# Altium project Ball_dropper.PrjPcb
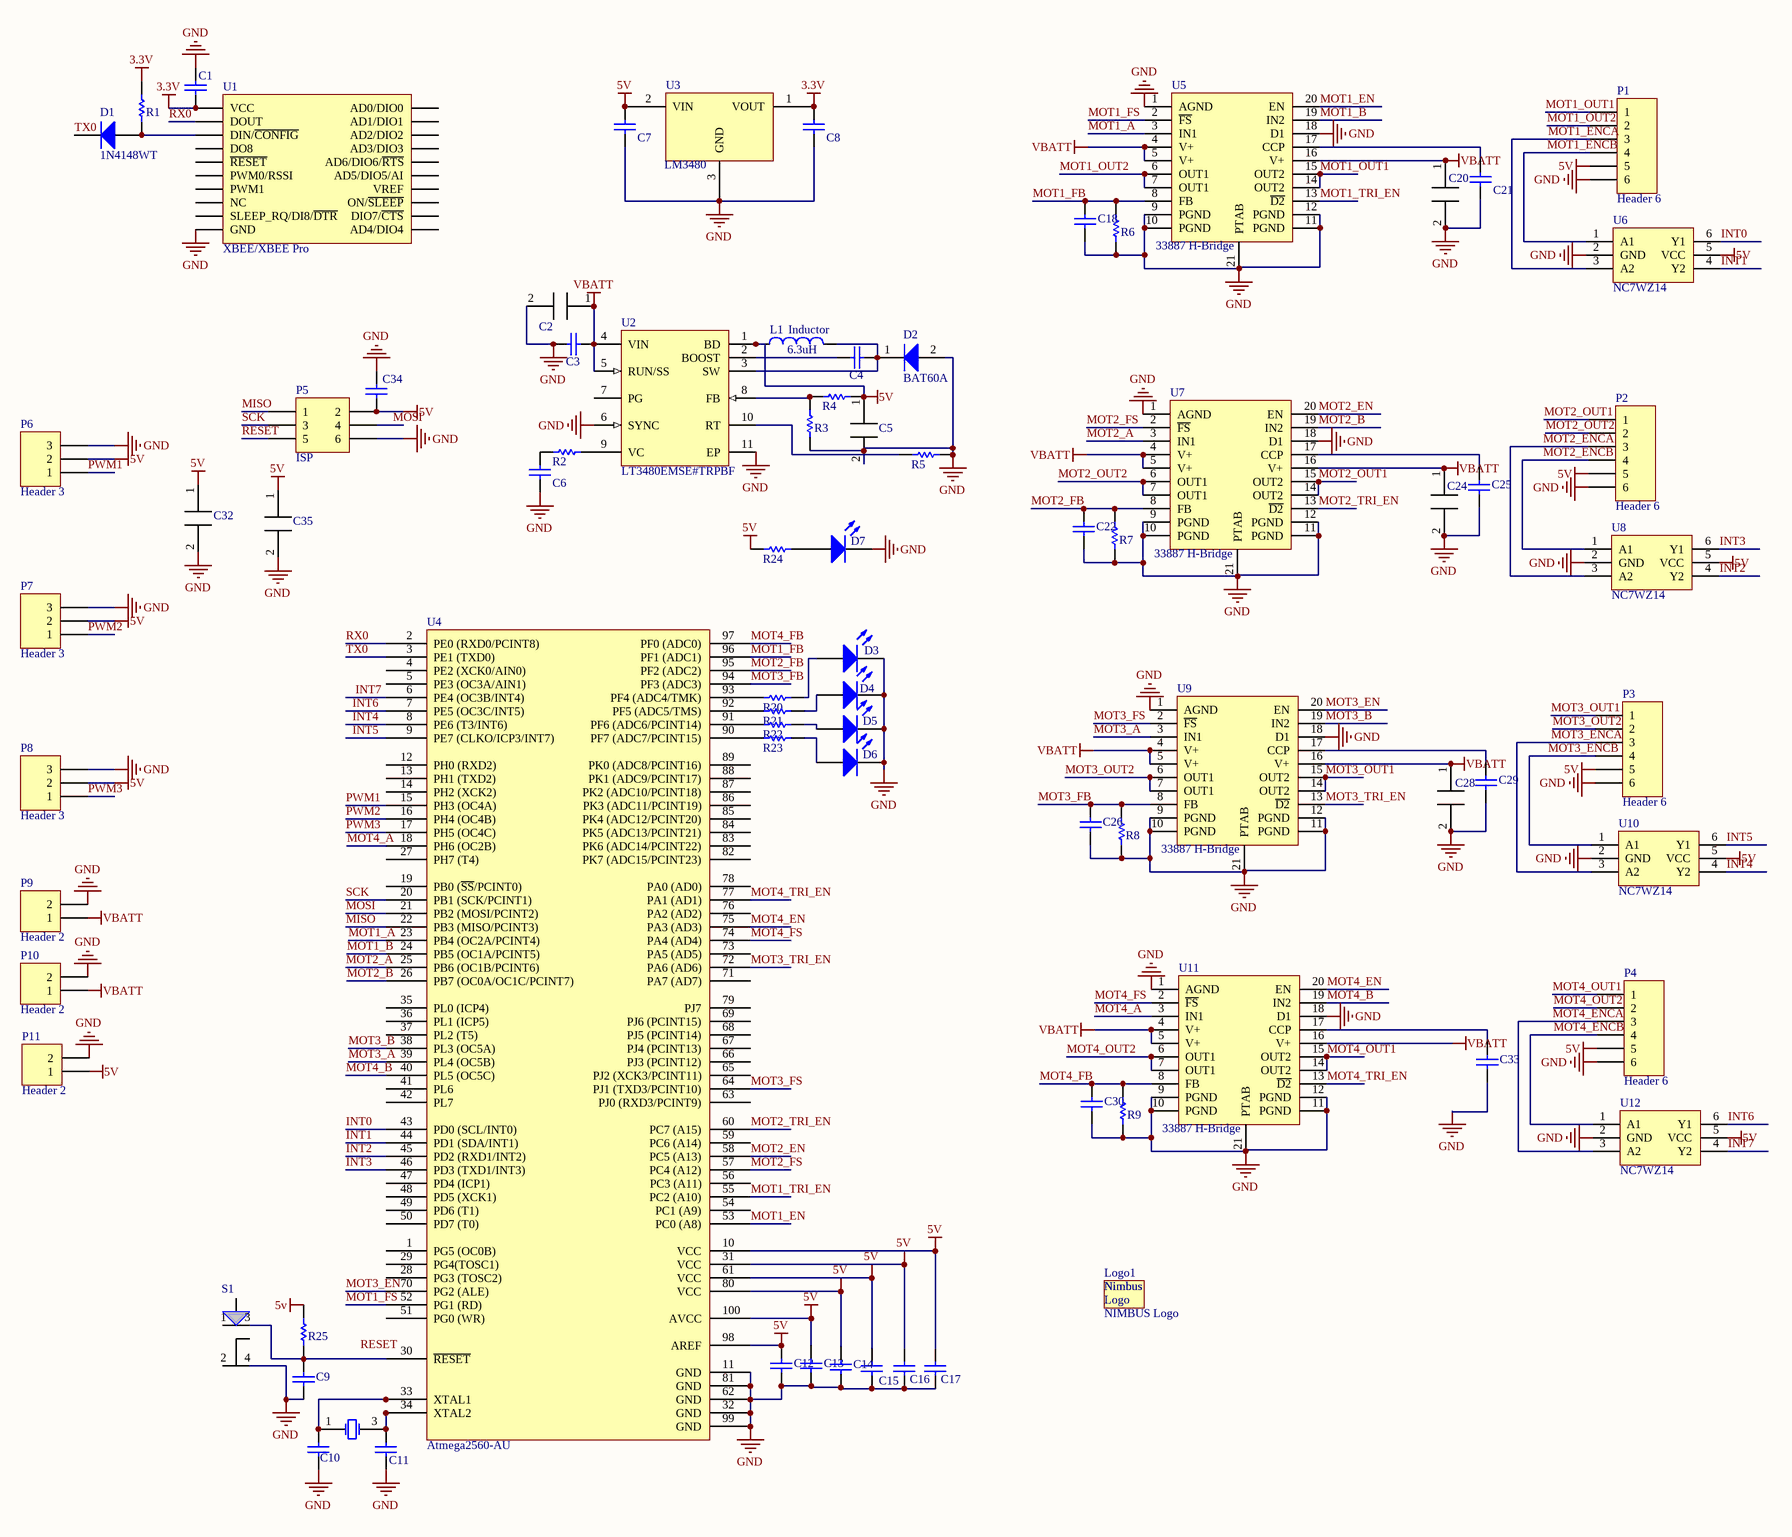
[diagram p0: Ball_Dropper.SchDoc]
1 sheet, 80 parts. Net scope: global (net labels, ports and power ports of the same name join across sheets).
Board file: Ball_Dropper.PcbDoc

## Sheet Ball_Dropper.SchDoc
size 513 x 462 mm

### Parts
C1  CAP 100nF 10V 0603(1608)  [CAPC0603(1608)100_N]  (value not drawn)
C2  TantalumCap7343  [TantalumCap7343]  (value not drawn)
C3  CAP 10uF 10V 0603(1608)  [CAPC0603(1608)100_M]  (value not drawn)
C4  CAP 470nF 16V 0603(1608)  [CAPC0603(1608)100_N]  (value not drawn)
C5  TantalumCap7343  [TantalumCap7343]  (value not drawn)
C6  CAP 470pF 16V 0603(1608)  [CAPC0603(1608)100_N]  (value not drawn)
C7  CAP 470nF 10V 0603(1608)  [CAPC0603(1608)100_N]  (value not drawn)
C8  CAP 33uF 10V 1206(3216)  [CAPC1206(3216)190_M]  (value not drawn)
C9  CAP 10nF 10V 0603(1608)  [CAPC0603(1608)100_M]  (value not drawn)
C10  CAP 22pF 10V 0603(1608)  [CAPC0603(1608)100_M]  (value not drawn)
C11  CAP 22pF 10V 0603(1608)  [CAPC0603(1608)100_M]  (value not drawn)
C12  CAP 100nF 10V 0603(1608)  [CAPC0603(1608)100_N]  (value not drawn)
C13  CAP 100nF 10V 0603(1608)  [CAPC0603(1608)100_N]  (value not drawn)
C14  CAP 100nF 10V 0603(1608)  [CAPC0603(1608)100_N]  (value not drawn)
C15  CAP 100nF 10V 0603(1608)  [CAPC0603(1608)100_N]  (value not drawn)
C16  CAP 100nF 10V 0603(1608)  [CAPC0603(1608)100_N]  (value not drawn)
C17  CAP 100nF 10V 0603(1608)  [CAPC0603(1608)100_N]  (value not drawn)
C18  CAP 1uF 25V 1206(3216)  [CAPC1206(3216)130_M]  (value not drawn)
C20  TantalumCap7343  [TantalumCap7343]  (value not drawn)
C21  CAP 33nF 25V 1206(3216)  [CAPC1206(3216)100_N]  (value not drawn)
C22  CAP 1uF 25V 1206(3216)  [CAPC1206(3216)130_M]  (value not drawn)
C24  TantalumCap7343  [TantalumCap7343]  (value not drawn)
C25  CAP 33nF 25V 1206(3216)  [CAPC1206(3216)100_L]  (value not drawn)
C26  CAP 1uF 25V 1206(3216)  [CAPC1206(3216)130_M]  (value not drawn)
C28  TantalumCap7343  [TantalumCap7343]  (value not drawn)
C29  CAP 33nF 25V 1206(3216)  [CAPC1206(3216)100_N]  (value not drawn)
C30  CAP 1uF 25V 1206(3216)  [CAPC1206(3216)130_M]  (value not drawn)
C32  TantalumCap7343  [TantalumCap7343]  (value not drawn)
C33  CAP 33nF 25V 1206(3216)  [CAPC1206(3216)100_L]  (value not drawn)
C34  CAP 100nF 10V 0603(1608)  [CAPC0603(1608)100_N]  (value not drawn)
C35  TantalumCap7343  [TantalumCap7343]  (value not drawn)
D1  1N4148WT  [DIODE_SMC]
D2  BAT60A  [DIODE_SMC]
D3  LED0  [CAPC0603(1608)55_N]  (value not drawn)
D4  LED0  [CAPC0603(1608)55_N]  (value not drawn)
D5  LED0  [CAPC0603(1608)55_N]  (value not drawn)
D6  LED0  [CAPC0603(1608)55_N]  (value not drawn)
D7  LED0  [CAPC0603(1608)55_N]  (value not drawn)
L1  Inductor  value 6.3uH  [TYS6045]
Logo1  NIMBUS Logo  [NIMBUS Logo]
P1  Header 6  [DF3A-6P-2DS]
P2  Header 6  [DF3A-6P-2DS]
P3  Header 6  [DF3A-6P-2DS]
P4  Header 6  [DF3A-6P-2DS]
P5  ISP  [HDR2X3]
P6  Header 3  [HDR1X3]
P7  Header 3  [HDR1X3]
P8  Header 3  [HDR1X3]
P9  Header 2  [DF3A-2P-2DS]
P10  Header 2  [DF3A-2P-2DS]
P11  Header 2  [DF3A-2P-2DS]
R1  10K 5% 0603(1608)  [RESC0603(1608)_N]  (value not drawn)
R2  16K2 1% 0603(1608)  [RESC0603(1608)_N]  (value not drawn)
R3  100K 5% 0603(1608)  [RESC0603(1608)_N]  (value not drawn)
R4  536K 1% 0603(1608)  [RESC0603(1608)_M]  (value not drawn)
R5  40K2 1% 0603(1608)  [RESC0603(1608)_M]  (value not drawn)
R6  100R 5% 0603(1608)  [RESC0603(1608)_N]  (value not drawn)
R7  100R 5% 0603(1608)  [RESC0603(1608)_N]  (value not drawn)
R8  100R 5% 0603(1608)  [RESC0603(1608)_N]  (value not drawn)
R9  100R 5% 0603(1608)  [RESC0603(1608)_N]  (value not drawn)
R20  330R 5% 0603(1608)  [RESC0603(1608)_N]  (value not drawn)
R21  330R 5% 0603(1608)  [RESC0603(1608)_N]  (value not drawn)
R22  330R 5% 0603(1608)  [RESC0603(1608)_N]  (value not drawn)
R23  330R 5% 0603(1608)  [RESC0603(1608)_N]  (value not drawn)
R24  330R 5% 0603(1608)  [RESC0603(1608)_L]  (value not drawn)
R25  4K7 5% 0603(1608)  [RESC0603(1608)_N]  (value not drawn)
S1  TactileSwitch  [TactileSwitch]  (value not drawn)
U1  XBEE/XBEE Pro  [XBEE PRO]
U2  LT3480EMSE#TRPBF  [LT-MSE-10-EDP_L]
U3  LM3480  [LM3480]
U4  Atmega2560-AU  [100T1_L]
U5  33887 H-Bridge  [MC33887]
U6  NC7WZ14  [NC7WZ14]
U7  33887 H-Bridge  [MC33887]
U8  NC7WZ14  [NC7WZ14]
U9  33887 H-Bridge  [MC33887]
U10  NC7WZ14  [NC7WZ14]
U11  33887 H-Bridge  [MC33887]
U12  NC7WZ14  [NC7WZ14]
Y1  FQ5032B-20  [FOX-FQ5032B_V]  (value not drawn)  (part A of 2)

### Nets
3.3V: C1.1 C8.2 R1.2 U1.1(VCC) U3.1(VOUT)
5V: C5.1(VCC) C7.2 C12.2 C13.2 C14.2 C15.1 C16.2 C17.2 C32.1(VCC) C34.1 C35.1(VCC) L1.1 P1.5 P2.5 P3.5 P4.5 P5.2 P6.2 P7.2 P8.2 P11.1 R4.2 R24.1 R25.2 U2.1(BD) U3.2(VIN) U4.10(VCC) U4.31(VCC) U4.61(VCC) U4.80(VCC) U4.98(AREF) U4.100(AVCC) U6.5(VCC) U8.5(VCC) U10.5(VCC) U12.5(VCC)
GND: C1.2 C2.2(GND) C3.1 C5.2(GND) C6.1 C7.1 C8.1 C9.1 C10.1 C11.1 C12.1 C13.1 C14.1 C15.2 C16.1 C17.1 C18.1 C20.2(GND) C21.1 C22.1 C24.2(GND) C25.1 C26.1 C28.2(GND) C29.1 C30.1 C32.2(GND) C33.1 C34.2 C35.2(GND) D2.2(A) D3.2(K) D4.2(K) D5.2(K) D6.2(K) D7.2(K) P1.6 P2.6 P3.6 P4.6 P5.6 P6.3 P7.3 P8.3 P9.2 P10.2 P11.2 R3.1 R5.2 R6.1 R7.1 R8.1 R9.1 S1.4(GND) U1.10(GND) U2.6(SYNC) U2.11(EP) U3.3(GND) U4.11(GND) U4.32(GND) U4.62(GND) U4.81(GND) U4.99(GND) U5.1(AGND) U5.9(PGND) U5.10(PGND) U5.11(PGND) U5.12(PGND) U5.18(D1) U5.21(PTAB) U6.2(GND) U7.1(AGND) U7.9(PGND) U7.10(PGND) U7.11(PGND) U7.12(PGND) U7.18(D1) U7.21(PTAB) U8.2(GND) U9.1(AGND) U9.9(PGND) U9.10(PGND) U9.11(PGND) U9.12(PGND) U9.18(D1) U9.21(PTAB) U10.2(GND) U11.1(AGND) U11.9(PGND) U11.10(PGND) U11.11(PGND) U11.12(PGND) U11.18(D1) U11.21(PTAB) U12.2(GND)
VBATT: C2.1(VCC) C3.2 C20.1(VCC) C24.1(VCC) C28.1(VCC) P9.1 P10.1 U2.4(VIN) U2.5(RUN/SS) U5.4(V+) U5.5(V+) U5.16(V+) U7.4(V+) U7.5(V+) U7.16(V+) U9.4(V+) U9.5(V+) U9.16(V+) U11.4(V+) U11.5(V+) U11.16(V+)
INT0: U4.43(PD0_(SCL/INT0)) U6.6(Y1)
INT1: U4.44(PD1_(SDA/INT1)) U6.4(Y2)
INT2: U4.45(PD2_(RXD1/INT2)) U8.4(Y2)
INT3: U4.46(PD3_(TXD1/INT3)) U8.6(Y1)
INT4: U4.8(PE6_(T3/INT6)) U10.4(Y2)
INT5: U4.9(PE7_(CLKO/ICP3/INT7)) U10.6(Y1)
INT6: U4.7(PE5_(OC3C/INT5)) U12.6(Y1)
INT7: U4.6(PE4_(OC3B/INT4)) U12.4(Y2)
MISO: P5.1 U4.22(PB3_(MISO/PCINT3))
MOSI: P5.4 U4.21(PB2_(MOSI/PCINT2))
MOT1_A: U4.23(PB4_(OC2A/PCINT4)) U5.3(IN1)
MOT1_B: U4.24(PB5_(OC1A/PCINT5)) U5.19(IN2)
MOT1_EN: U4.53(PC0_(A8)) U5.20(EN)
MOT1_ENCA: P1.3 U6.3(A2)
MOT1_ENCB: P1.4 U6.1(A1)
MOT1_FB: C18.2 R6.2 U4.96(PF1_(ADC1)) U5.8(FB)
MOT1_FS: U4.52(PG1_(RD)) U5.2(~{FS})
MOT1_OUT1: P1.1 U5.14(OUT2) U5.15(OUT2)
MOT1_OUT2: P1.2 U5.6(OUT1) U5.7(OUT1)
MOT1_TRI_EN: U4.55(PC2_(A10)) U5.13(~{D2})
MOT2_A: U4.25(PB6_(OC1B/PCINT6)) U7.3(IN1)
MOT2_B: U4.26(PB7_(OC0A/OC1C/PCINT7)) U7.19(IN2)
MOT2_EN: U4.58(PC5_(A13)) U7.20(EN)
MOT2_ENCA: P2.3 U8.3(A2)
MOT2_ENCB: P2.4 U8.1(A1)
MOT2_FB: C22.2 R7.2 U4.95(PF2_(ADC2)) U7.8(FB)
MOT2_FS: U4.57(PC4_(A12)) U7.2(~{FS})
MOT2_OUT1: P2.1 U7.14(OUT2) U7.15(OUT2)
MOT2_OUT2: P2.2 U7.6(OUT1) U7.7(OUT1)
MOT2_TRI_EN: U4.60(PC7_(A15)) U7.13(~{D2})
MOT3_A: U4.39(PL4_(OC5B)) U9.3(IN1)
MOT3_B: U4.38(PL3_(OC5A)) U9.19(IN2)
MOT3_EN: U4.70(PG2_(ALE)) U9.20(EN)
MOT3_ENCA: P3.3 U10.3(A2)
MOT3_ENCB: P3.4 U10.1(A1)
MOT3_FB: C26.2 R8.2 U4.94(PF3_(ADC3)) U9.8(FB)
MOT3_FS: U4.64(PJ1_(TXD3/PCINT10)) U9.2(~{FS})
MOT3_OUT1: P3.1 U9.14(OUT2) U9.15(OUT2)
MOT3_OUT2: P3.2 U9.6(OUT1) U9.7(OUT1)
MOT3_TRI_EN: U4.72(PA6_(AD6)) U9.13(~{D2})
MOT4_A: U4.18(PH6_(OC2B)) U11.3(IN1)
MOT4_B: U4.40(PL5_(OC5C)) U11.19(IN2)
MOT4_EN: U4.75(PA3_(AD3)) U11.20(EN)
MOT4_ENCA: P4.3 U12.3(A2)
MOT4_ENCB: P4.4 U12.1(A1)
MOT4_FB: C30.2 R9.2 U4.97(PF0_(ADC0)) U11.8(FB)
MOT4_FS: U4.74(PA4_(AD4)) U11.2(~{FS})
MOT4_OUT1: P4.1 U11.14(OUT2) U11.15(OUT2)
MOT4_OUT2: P4.2 U11.6(OUT1) U11.7(OUT1)
MOT4_TRI_EN: U4.77(PA1_(AD1)) U11.13(~{D2})
PWM1: P6.1 U4.15(PH3_(OC4A))
PWM2: P7.1 U4.16(PH4_(OC4B))
PWM3: P8.1 U4.17(PH5_(OC4C))
RESET: P5.5
RX0: U1.2(DOUT) U4.2(PE0_(RXD0/PCINT8))
SCK: P5.3 U4.20(PB1_(SCK/PCINT1))
TX0: D1.1(K) U4.3(PE1_(TXD0))
NetC4_1: C4.1 U2.2(BOOST)
NetC4_2: C4.2 D2.1(K) L1.2 U2.3(SW)
NetC6_2: C6.2 R2.1
NetC9_2: C9.2 R25.1 S1.3(GND) U4.30(~{RESET})
NetC10_2: C10.2 U4.33(XTAL1) Y1.1(X1)
NetC11_2: C11.2 U4.34(XTAL2) Y1.3(X2)
NetC21_2: C21.2 U5.17(CCP)
NetC25_2: C25.2 U7.17(CCP)
NetC29_2: C29.2 U9.17(CCP)
NetC33_2: C33.2 U11.17(CCP)
NetD1_2: D1.2(A) R1.1 U1.3(DIN/~{CONFIG})
NetD3_1: D3.1(A) R20.2
NetD4_1: D4.1(A) R21.2
NetD5_1: D5.1(A) R22.2
NetD6_1: D6.1(A) R23.2
NetD7_1: D7.1(A) R24.2
NetR2_2: R2.2 U2.9(VC)
NetR3_2: R3.2 R4.1 U2.8(FB)
NetR5_1: R5.1 U2.10(RT)
NetR20_1: R20.1 U4.93(PF4_(ADC4/TMK))
NetR21_1: R21.1 U4.92(PF5_(ADC5/TMS))
NetR22_1: R22.1 U4.91(PF6_(ADC6/PCINT14))
NetR23_1: R23.1 U4.90(PF7_(ADC7/PCINT15))

Not connected (* = marked no-connect by the designer): S1 1(GND) 2(GND); U1 4(DO8) 5(~{RESET}) 6(PWM0/RSSI) 7(PWM1) 8(NC) 9(SLEEP_RQ/DI8/~{DTR}) 11(AD4/DIO4) 12(DIO7/~{CTS}) 13(ON/~{SLEEP}) 14(VREF) 15(AD5/DIO5/AI) 16(AD6/DIO6/~{RTS}) 17(AD3/DIO3) 18(AD2/DIO2) 19(AD1/DIO1) 20(AD0/DIO0); U2 7(PG); U4 1(PG5_(OC0B)) 4(PE2_(XCK0/AIN0)) 5(PE3_(OC3A/AIN1)) 12(PH0_(RXD2)) 13(PH1_(TXD2)) 14(PH2_(XCK2)) 19(PB0_(~{SS}/PCINT0)) 27(PH7_(T4)) 28(PG3_(TOSC2)) 29(PG4(TOSC1)) 35(PL0_(ICP4)) 36(PL1_(ICP5)) 37(PL2_(T5)) 41(PL6) 42(PL7) 47(PD4_(ICP1)) 48(PD5_(XCK1)) 49(PD6_(T1)) 50(PD7_(T0)) 51(PG0_(WR)) 54(PC1_(A9)) 56(PC3_(A11)) 59(PC6_(A14)) 63(PJ0_(RXD3/PCINT9)) 65(PJ2_(XCK3/PCINT11)) 66(PJ3_(PCINT12)) 67(PJ4_(PCINT13)) 68(PJ5_(PCINT14)) 69(PJ6_(PCINT15)) 71(PA7_(AD7)) 73(PA5_(AD5)) 76(PA2_(AD2)) 78(PA0_(AD0)) 79(PJ7) 82(PK7_(ADC15/PCINT23)) 83(PK6_(ADC14/PCINT22)) 84(PK5_(ADC13/PCINT21)) 85(PK4_(ADC12/PCINT20)) 86(PK3_(ADC11/PCINT19)) 87(PK2_(ADC10/PCINT18)) 88(PK1_(ADC9/PCINT17)) 89(PK0_(ADC8/PCINT16))

### Notes on the sheet
- Labels drawn without touching a wire or pin: RESET
- (in symbol NIMBUS Logo) Nimbus; Logo

### Library data of the parts
C1 C12-C17 C34 = CMP-1035-02582-1: CAP 100nF 10V -20% to +80% 0603 (1608 Metric) Thickness 1mm SMD; Case-Metric: 1608; Case-EIA: 0603; Rated Voltage: 10 V; Value: 100nF; Technology: SMT; Max Thickness: 1 mm; Tolerance: -20% to +80%
C2 = TantalumCap7343: 100uF; C: 100uF
C3 = CMP-1035-02800-1: CAP 10uF 10V ±20% 0603 (1608 Metric) Thickness 1mm SMD; Case-EIA: 0603; Case-Metric: 1608; Tolerance: ±20%; Max Thickness: 1 mm; Rated Voltage: 10 V; Technology: SMT; Value: 10uF
C4 = CMP-1035-02701-1: CAP 470nF 16V ±20% 0603 (1608 Metric) Thickness 1mm SMD; Case-EIA: 0603; Case-Metric: 1608; Rated Voltage: 16 V; Max Thickness: 1 mm; Value: 470nF; Technology: SMT; Tolerance: ±20%
C5 C20 C24 C28 C32 C35 = TantalumCap7343: 47uF; C: 47uF
C6 = CMP-1035-01664-1: CAP 470pF 16V ±2% 0603 (1608 Metric) Thickness 1mm SMD; Case-EIA: 0603; Case-Metric: 1608; Rated Voltage: 16 V; Max Thickness: 1 mm; Tolerance: ±2%; Technology: SMT; Value: 470pF
C7 = CMP-1035-02696-1: CAP 470nF 10V ±10% 0603 (1608 Metric) Thickness 1mm SMD; Case-EIA: 0603; Case-Metric: 1608; Tolerance: ±10%; Max Thickness: 1 mm; Value: 470nF; Technology: SMT; Rated Voltage: 10 V
C8 = CMP-1037-04997-1: CAP 33uF 10V ±20% 1206 (3216 Metric) Thickness 1.9mm SMD; Case-EIA: 1206; Case-Metric: 3216; Technology: SMT; Max Thickness: 1.9 mm; Rated Voltage: 10 V; Tolerance: ±20%; Value: 33uF
C9 = CMP-1035-02304-1: CAP 10nF 10V ±2% 0603 (1608 Metric) Thickness 1mm SMD; Case-EIA: 0603; Case-Metric: 1608; Technology: SMT; Tolerance: ±2%; Rated Voltage: 10 V; Value: 10nF; Max Thickness: 1 mm
C10 C11 = CMP-1035-00797-1: CAP 22pF 10V ±0.25pF 0603 (1608 Metric) Thickness 1mm SMD; Case-Metric: 1608; Case-EIA: 0603; Tolerance: ±0.25pF; Max Thickness: 1 mm; Technology: SMT; Value: 22pF; Rated Voltage: 10 V
C18 C22 C26 C30 = CMP-1037-04697-1: CAP 1uF 25V ±5% 1206 (3216 Metric) Thickness 1.3mm SMD; Case-EIA: 1206; Case-Metric: 3216; Max Thickness: 1.3 mm; Tolerance: ±5%; Value: 1uF; Rated Voltage: 25 V; Technology: SMT
C21 = CMP-1037-03874-1: CAP 33nF 25V ±20% 1206 (3216 Metric) Thickness 1mm SMD; Case-EIA: 1206; Case-Metric: 3216; Rated Voltage: 25 V; Max Thickness: 1 mm; Tolerance: ±20%; Value: 33nF; Technology: SMT
C25 C29 C33 = CMP-1037-03869-1: CAP 33nF 25V ±1% 1206 (3216 Metric) Thickness 1mm SMD; Case-Metric: 3216; Case-EIA: 1206; Tolerance: ±1%; Max Thickness: 1 mm; Value: 33nF; Rated Voltage: 25 V; Technology: SMT
D1 = CMP-0881-00001-1: High Conductance Fast Switching Diode, 75 V, -55 to 150 degC, 2-Pin SOD523F, RoHS; Manufacturer: Fairchild Semiconductor; IR (VR: 75 V)=5 uA Max.; VF: 1 V Max.; BVR (IR: 5 uA)=75 V Min.; CO: 4 pF Max.; DatasheetVersion: Rev. A2; ComponentLink1Description: Manufacturer URL; PackageDescription: 2-Pin Surface Mount Device, Body 1.2 x 0.8 mm, Height 0.7 mm; ComponentLink2URL: http://www.fairchildsemi.com/ds/1N/1N4148WT.pdf; ComponentLink2Description: Datasheet; PartNumber: 1N4148WT; ComponentLink1URL: http://www.fairchildsemi.com/; Temperature Range: -55 to 150 degC; Mounting Technology: Surface Mount; PackageReference: SOD-523F-2; RoHS: TRUE
D2 = CMP-1183-00008-1: Silicon Schottky Diode, -55 to 85 degC, SOD323, Reel, Green; Manufacturer: Infineon; VF (max): 370 mV; Configuration: Single; IF (max): 3,000 mA; CT (max): 35 pF; VR (max): 10 V; Green: TRUE; ComponentLink3Description: Package Specification; ComponentLink1Description: Manufacturer URL; Mounting Technology: Surface Mount; ComponentLink1URL: http://www.infineon.com/; ComponentLink2URL: http://www.infineon.com/dgdl/bat60aseries.pdf?folderId=db3a304313d846880113def5812204a1&fileId=db3a304313d846880113def70c9304a9; ComponentLink2Description: Datasheet; Packing: Reel; PackageDescription: 3-Pin Small Outline Transistor Package, 1.25 x 2 mm Body, 0.65 mm Pitch; ComponentLink3URL: http://www.infineon.com/dgdl/SOT323-Package_Overview.pdf?folderId=db3a30431936bc4b0119533e1dcb3c92&fileId=db3a30431936bc4b011953495f283cb1; PackageReference: SOT323; PartNumber: BAT60A
D3-D7 = LED0: Typical INFRARED GaAs LED; Published: 8-Jun-2000; LatestRevisionDate: 08-Jul-2005; LatestRevisionNote: Mech Layer 1 removed.; PackageReference: LED-0; Publisher: Altium Limited; PackageDescription: LED; 2 Leads
L1 = Inductor: Code_IEC: 1005; Published: 8-Jun-2000; LatestRevisionDate: 29-May-2009; LatestRevisionNote: IPC-7351 Footprint Added.; PackageReference: 0402-A; Publisher: Altium Limited; PackageDescription: Chip Inductor; Code_JEITA: 0402
P1-P4 = Header 6: Header, 6-Pin; LatestRevisionDate: 17-Jul-2002; LatestRevisionNote: Re-released for DXP Platform.; Publisher: Altium Limited
P5 = Header 3X2: Header, 3-Pin, Dual row; LatestRevisionDate: 17-Jul-2002; LatestRevisionNote: Re-released for DXP Platform.; Publisher: Altium Limited
P6-P8 = Header 3: Header, 3-Pin; LatestRevisionDate: 17-Jul-2002; LatestRevisionNote: Re-released for DXP Platform.; Publisher: Altium Limited
P9-P11 = Header 2: Header, 2-Pin; LatestRevisionDate: 17-Jul-2002; LatestRevisionNote: Re-released for DXP Platform.; Publisher: Altium Limited
R1 = CMP-1012-00098-1: 10K 0.1W 5% 0603 (1608 Metric)  SMD; Case-EIA: 0603; Value: 10000.00 Ohm; Case-Metric: 1608; Technology: SMT; Tolerance: 5 %; Power: 0.1 W
R2 = CMP-1012-00645-1: 16K2 0.1W 1% 0603 (1608 Metric)  SMD; Case-EIA: 0603; Value: 16200.00 Ohm; Case-Metric: 1608; Power: 0.1 W; Tolerance: 1 %; Technology: SMT
R3 = CMP-1012-00122-1: 100K 0.1W 5% 0603 (1608 Metric)  SMD; Case-EIA: 0603; Value: 100000.00 Ohm; Case-Metric: 1608; Tolerance: 5 %; Power: 0.1 W; Technology: SMT
R4 = CMP-1012-00819-1: 536K 0.1W 1% 0603 (1608 Metric)  SMD; Case-EIA: 0603; Case-Metric: 1608; Value: 536000.00 Ohm; Tolerance: 1 %; Power: 0.1 W; Technology: SMT
R5 = CMP-1012-00691-1: 40K2 0.1W 1% 0603 (1608 Metric)  SMD; Case-Metric: 1608; Value: 40200.00 Ohm; Case-EIA: 0603; Tolerance: 1 %; Technology: SMT; Power: 0.1 W
R6-R9 = CMP-1012-00050-1: 100R 0.1W 5% 0603 (1608 Metric)  SMD; Case-EIA: 0603; Value: 100.00 Ohm; Case-Metric: 1608; Tolerance: 5 %; Technology: SMT; Power: 0.1 W
R20-R24 = CMP-1012-00062-1: 330R 0.1W 5% 0603 (1608 Metric)  SMD; Value: 330.00 Ohm; Case-EIA: 0603; Case-Metric: 1608; Tolerance: 5 %; Power: 0.1 W; Technology: SMT
R25 = CMP-1012-00090-1: 4K7 0.1W 5% 0603 (1608 Metric)  SMD; Case-Metric: 1608; Value: 4700.00 Ohm; Case-EIA: 0603; Tolerance: 5 %; Technology: SMT; Power: 0.1 W
U1 = Xbee Pro
U2 = CMP-0491-01005-1: 2 A, 2.4 MHz Step-Down Switching Regulator with 70 uA Quiescent Current, 10-pin SOP (MSE-10-EDP), -40 to 85 degC, Pb-Free, Tape and Reel; Manufacturer: Linear Technology; Number of Outputs: 1; Over Voltage Protection(V): 60; ComponentLink3Description: Package Specification; PartNumber: LT3480EMSE#TRPBF; PackageVersion: Rev. I, 05/2013; PackageDescription: 10-Pin Plastic MSOP, Exposed Die Pad, Body 3 x 3 mm, Pitch 0.5 mm; ComponentLink1URL: http://www.linear.com/; ComponentLink3URL: http://cds.linear.com/docs/en/packaging/05081664_I_MSE.pdf; ComponentLink1Description: Manufacturer URL; PackageReference: MSE-10; RoHS: TRUE; Packing: Tape and Reel; Mounting Technology: Surface Mount; ComponentLink2Description: Datasheet; ComponentLink2URL: http://cds.linear.com/docs/en/datasheet/3480fe.pdf
U3 = LM3480: LM3480IM3-3.3/NOPBCT-ND
U4 = Atmega2560-AU: ATMEGA2560-16AURCT-ND
U5 U7 U9 U11 = 33887 H Bridge: MC33887APVWR2CT-ND
U6 U8 U10 U12 = NC7WZ14: NC7WZ14P6XCT-ND
Y1 = CMP-0399-00002-1: Crystal Oscillator, SMD, 20MHz, Stab=30ppm 20.0pF; Manufacturer: FOX Electronics; Frequency Tolerance: +/-30 ppm; ComponentLink1URL: http://www.foxonline.com/; Nominal Frequency: 20 MHz; ComponentLink2Description: Datasheet; Storage Temperature: -40 to 85 degC; Mounting Technology: Surface Mount; ComponentLink2URL: http://www.foxonline.com/pdfs/fq5032.pdf; PackageDescription: 4-Pin SMT Crystal, 5.2 x 3.4 mm Body; PackageReference: FQ5032B; ComponentLink1Description: Manufacturer URL; PartNumber: FQ5032B-20; DatasheetVersion: Mar-10